# Altium project SoldeerStation2223.PrjPcb
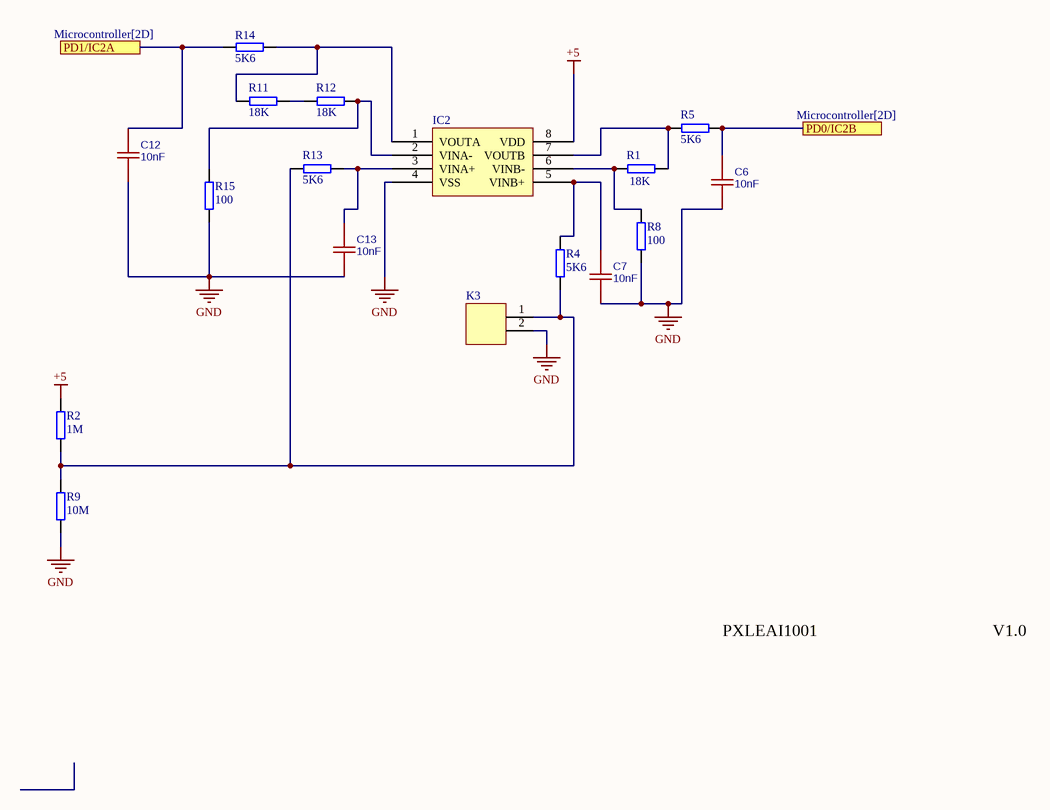
[diagram p0: Thermokoppel.SchDoc]
5 sheets, 78 parts. Net scope: flat (ports and power ports of the same name join across sheets).
Board files: PCBV1.PcbDoc, Display.PcbDoc, PCBV2.PcbDoc
Sheets:
  Thermokoppel.SchDoc
  Voeding.SchDoc
  Display.SchDoc
  Microcontroller.SchDoc
  PWMSoldeerbout.SchDoc

## Sheet Thermokoppel.SchDoc: Soldeerstation
size A4; Author: Alexander Petry; CompanyName: PXL; SheetNumber: 1; SheetTotal: 5

### Parts
C6  10nF  [C6,7,12,13 10nF]
C7  10nF  [C6,7,12,13 10nF]
C12  10nF  [C6,7,12,13 10nF]
C13  10nF  [C6,7,12,13 10nF]
IC2  (no value)  [IC2 opamps]
K3  (no value)  [Terminal_2]
R1  18K  [RESC2013X50X30ML20T20]
R2  1M  [RESC2013X50X30ML20T20]
R4  5K6  [RESC2013X50X30ML20T20]
R5  5K6  [RESC2013X50X30ML20T20]
R8  100  [RESC2013X50X30ML20T20]
R9  10M  [RESC2013X50X30ML20T20]
R11  18K  [RESC2013X50X30ML20T20]
R12  18K  [RESC2013X50X30ML20T20]
R13  5K6  [RESC2013X50X30ML20T20]
R14  5K6  [RESC2013X50X30ML20T20]
R15  100  [RESC2013X50X30ML20T20]

### Ports
PD0/IC2B (see Microcontroller[2D]), PD1/IC2A (see Microcontroller[2D])

### Nets
+5: IC2.8(VDD) R2.2
GND: C6.1 C7.1 C12.1 C13.1 IC2.4(VSS) K3.2 R8.1 R9.1 R15.1
NetC6_2: C6.2 R5.1 ; port PD0/IC2B
NetC7_2: C7.2 IC2.5(VINB+) R4.1
NetC12_2: C12.2 R14.1 ; port PD1/IC2A
NetC13_2: C13.2 IC2.3(VINA+) R13.2
NetIC2_1: IC2.1(VOUTA) R11.2 R14.2
NetIC2_2: IC2.2(VINA-) R12.2 R15.2
NetIC2_6: IC2.6(VINB-) R1.1 R8.2
NetIC2_7: IC2.7(VOUTB) R1.2 R5.2
NetK3_1: K3.1 R2.1 R4.2 R9.2 R13.1
NetR11_1: R11.1 R12.1

### Notes on the sheet
- PXLEAI1001
- V1.0

### Library data of the parts
C6 C7 C12 C13 = C6,7,12,13 10nF: BOM_Manufacturer: CCTC(三环); BOM_Manufacturer Part: TCC0805X7R103M500DT; nameAlias: Capacitance; Contributor: LCSC; BOM_Supplier: LCSC; BOM_Supplier Part: C376921; BOM_JLCPCB Part Class: Extended Part; spicePre: C; spiceSymbolName: TCC0805X7R103M500DT
IC2 = IC2 dual opamps
K3 = K Terminal_2
R1 R2 R4 R5 R8 R9 R11-R15 = R Resistor: Manufacturer: Vishay Dale; Part Number: CRCW08050000Z0EA

## Sheet Voeding.SchDoc
size A4; SheetNumber: 2; SheetTotal: 5
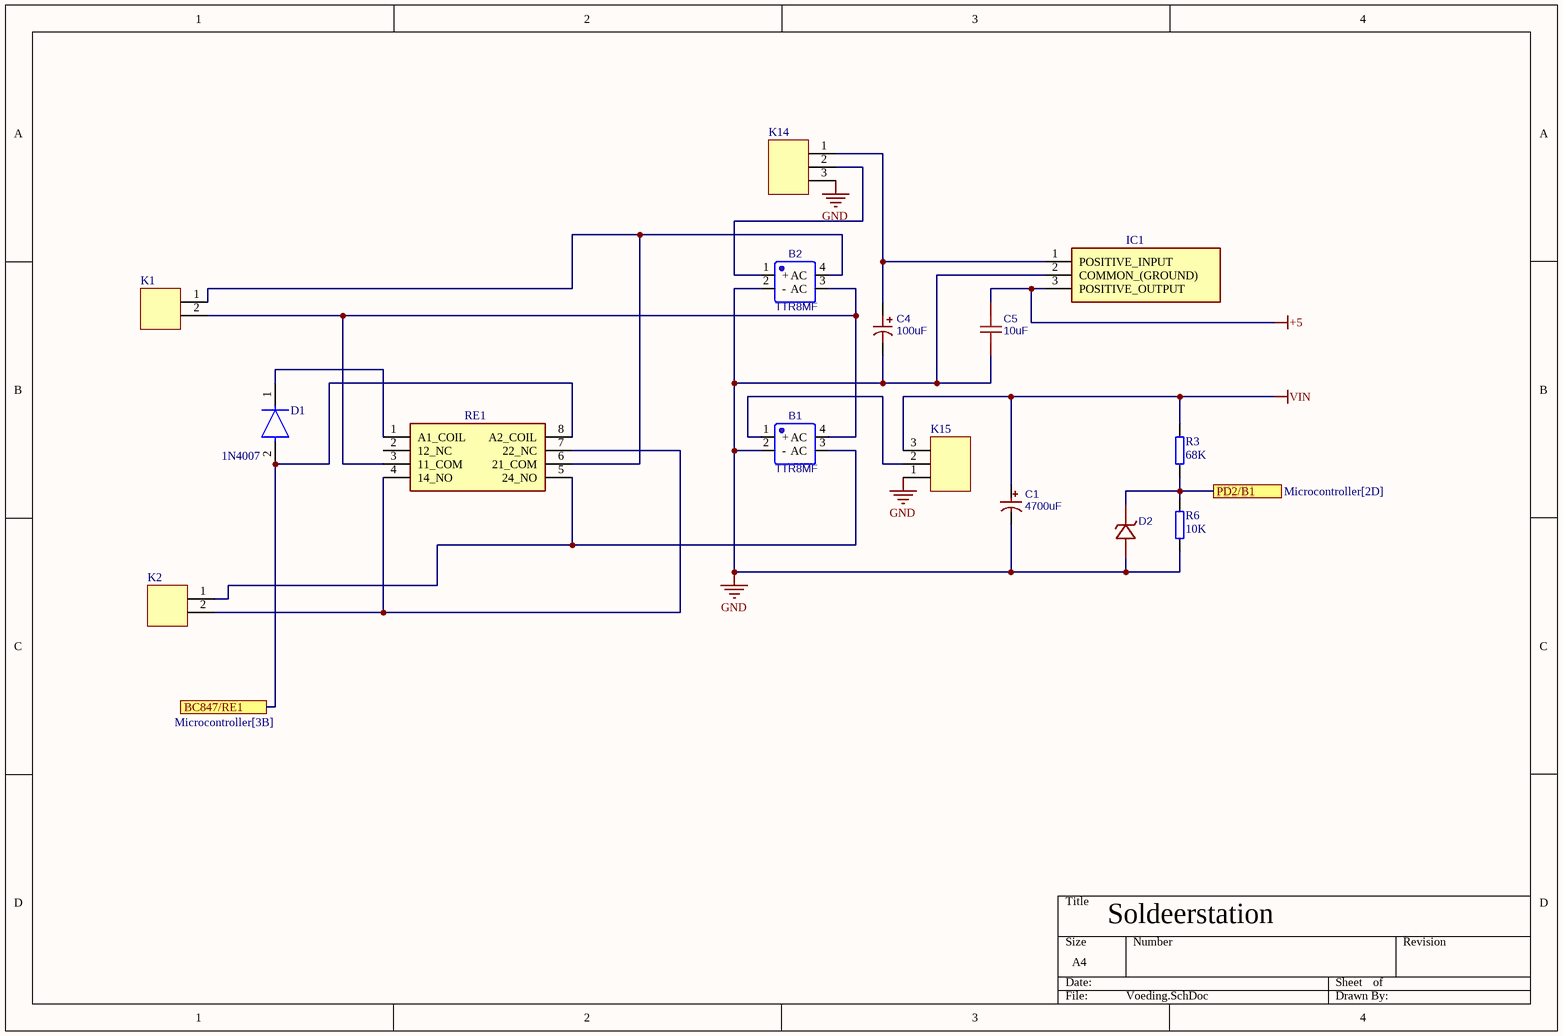
[diagram p1: Voeding.SchDoc]

### Parts
B1  TTR8MF  [B1,2 Brug gelijkrichter]
B2  TTR8MF  [B1,2 Brug gelijkrichter]
C1  4700uF  [C1 4700uF]
C4  100uF  [C4 100uF]
C5  10uF  [C2,5,10 10uF]
D1  1N4007  [FP-1N4007-MFG]
D2  (no value)  [D2 zener diode]
IC1  (no value)  [IC1 DC-DC converter]
K1  (no value)  [Terminal_2]
K2  (no value)  [Terminal_2]
K14  (no value)  [PInHeader_3]
K15  (no value)  [PInHeader_3]
R3  68K  [RESC2013X50X30ML20T20]
R6  10K  [RESC2013X50X30ML20T20]
RE1  (no value)  [RE1 Vermogen relais]

### Ports
BC847/RE1 (see Microcontroller[3B]), PD2/B1 (see Microcontroller[2D])

### Nets
+5: C5.2 IC1.3(POSITIVE_OUTPUT)
GND: B1.2(-) B2.2(-) C1.2 C4.2 C5.1 D2.2(A) IC1.2(COMMON_(GROUND)) K14.3 K15.1 R6.1
VIN: C1.1 K15.3 R3.2
NetB1_1: B1.1(+) K15.2
NetB1_3: B1.3(AC) K2.1 RE1.5(24_NO)
NetB1_4: B1.4(AC) B2.3(AC) K1.2 RE1.3(11_COM)
NetB2_1: B2.1(+) K14.2
NetB2_4: B2.4(AC) K1.1 RE1.6(21_COM)
NetC4_1: C4.1 IC1.1(POSITIVE_INPUT) K14.1
NetD1_1: D1.1(C) RE1.1(A1_COIL)
NetD1_2: D1.2(A) RE1.8(A2_COIL) ; port BC847/RE1
NetD2_1: D2.1(K) R3.1 R6.2 ; port PD2/B1
NetK2_2: K2.2 RE1.4(14_NO) RE1.7(22_NC)

Not connected (* = marked no-connect by the designer): RE1 2(12_NC)

### Notes on the sheet
- Soldeerstation

### Library data of the parts
B1 B2 = B1,2 Brug Gelijkrichter: BOM_Manufacturer: MDD; Contributor: LCSC; BOM_Supplier: LCSC; BOM_Supplier Part: C712546; BOM_Manufacturer Part: TTR8MF; BOM_JLCPCB Part Class: Extended Part; spicePre: D; spiceSymbolName: TTR8MF
C1 = C1 4700uF: BOM_Manufacturer: CX(承兴); BOM_Manufacturer Part: KM478M050N35RR0VH2FP0; nameAlias: Capacitance; BOM_Supplier: LCSC; BOM_Supplier Part: C45662; BOM_JLCPCB Part Class: Extended Part; spicePre: C; spiceSymbolName: 4700uF 50V 22*35
C4 = C4 100uF: BOM_Manufacturer: Nichicon(尼吉康); BOM_Manufacturer Part: UWT1H101MNL1GS; Contributor: LCSC; nameAlias: Capacitance; BOM_Supplier: LCSC; BOM_Supplier Part: C445063; BOM_JLCPCB Part Class: Extended Part; spicePre: C; spiceSymbolName: UWT1H101MNL1GS
C5 = C2,5,10 10uF: BOM_Manufacturer: muRata(村田); BOM_Manufacturer Part: GRM21BR61H106KE43L; nameAlias: Capacitance; Contributor: LCSC; BOM_Supplier: LCSC; BOM_Supplier Part: C440198; BOM_JLCPCB Part Class: Basic Part; spicePre: C; spiceSymbolName: GRM21BR61H106KE43L
D1 = zo_1N4007: DIODE GEN PURP 1KV 1A DO204AL; Manufacturer: Vishay; Manufacturer Part Number: 1N4007-E3/54; Value: 15pF; Max Junction Temp: +150°C; Max Surge Forward Current: 30A; Max Repetitive Reverse Voltage: 1000V; Peak Reverse Current: 30uA; Octopart: https://octopart.com/1n4007-e3%2F54-vishay-39548207; Digikey Description: DIODE GEN PURP 1KV 1A DO204AL; Category: Diode; Mouser Description: Rectifiers Vr/1000V Io/1A; Automotive: No; Package: 1N4007; Device Class L3: Rectifier Diodes; Temperature Range High: +150°C; Capacitance: 15pF; Ipc Land Pattern Name: DIOPA1088W105L520D270; Lead Free: Yes; ComponentLink2Description: Datasheet; Forward Current: 1A; Device Class L1: Discrete Semiconductors; ComponentLink2URL: http://www.vishay.com/docs/88503/1n4001.pdf; Temperature Range Low: -50°C; Height: 2.7mm; RoHS: TRUE; Temperature: -50°C to +150°C; Device Class L2: Diodes
D2 = D2 zener diode: BZT52C5V1_C1884555; BOM_Manufacturer: YFW(佑风微); Contributor: LCSC; BOM_Supplier: LCSC; BOM_Supplier Part: C1884555; BOM_Manufacturer Part: BZT52C5V1; BOM_JLCPCB Part Class: Extended Part; spicePre: D; spiceSymbolName: BZT52C5V1_C1884555
IC1 = IC1 OKI-78SR-5_1.5-W36-C: Non-Isolated DC/DC Converters 7.5W 24Vin 5Vout1 1.5A SIP Non-Iso; Manufacturer_Name: Murata Electronics; Manufacturer_Part_Number: OKI-78SR-5/1.5-W36-C; Geometry.Height: 16.5mm; Mouser Part Number: 580-OKI78SR5/1.5W36C; Mouser Price/Stock: https://www.mouser.co.uk/ProductDetail/Murata-Power-Solutions/OKI-78SR-5-1.5-W36-C?qs=uJpRT2lXVNXJP%252Bo08dQqJQ%3D%3D; Datasheet Link: https://www.murata.com/products/productdata/8807037992990/oki-78sr.pdf?1583754815000
K1 K2 = K Terminal_2
K14 K15 = K PinHeader_3
R3 R6 = R Resistor: as R1 on sheet Thermokoppel
RE1 = RE1 Vermogen relais: RT424005F  General Purpose Relays DPDT 8A 5VDC GEN PURPOSE RELAY; Manufacturer_Name: TE Connectivity; Mouser Part Number: 655-RT424005F; Mouser Price/Stock: https://www.mouser.co.uk/ProductDetail/TE-Connectivity-PB/RT424005F?qs=8wHch9UpSvaH%252B%252BmsSCbj0Q%3D%3D; Manufacturer_Part_Number: RT424005F; Datasheet Link: https://datasheet.datasheetarchive.com/originals/distributors/Datasheets_SAMA/2ef22a7a34dcc6453ddb52063c55ccaa.pdf

## Sheet Display.SchDoc
size A4; SheetNumber: 3; SheetTotal: 5
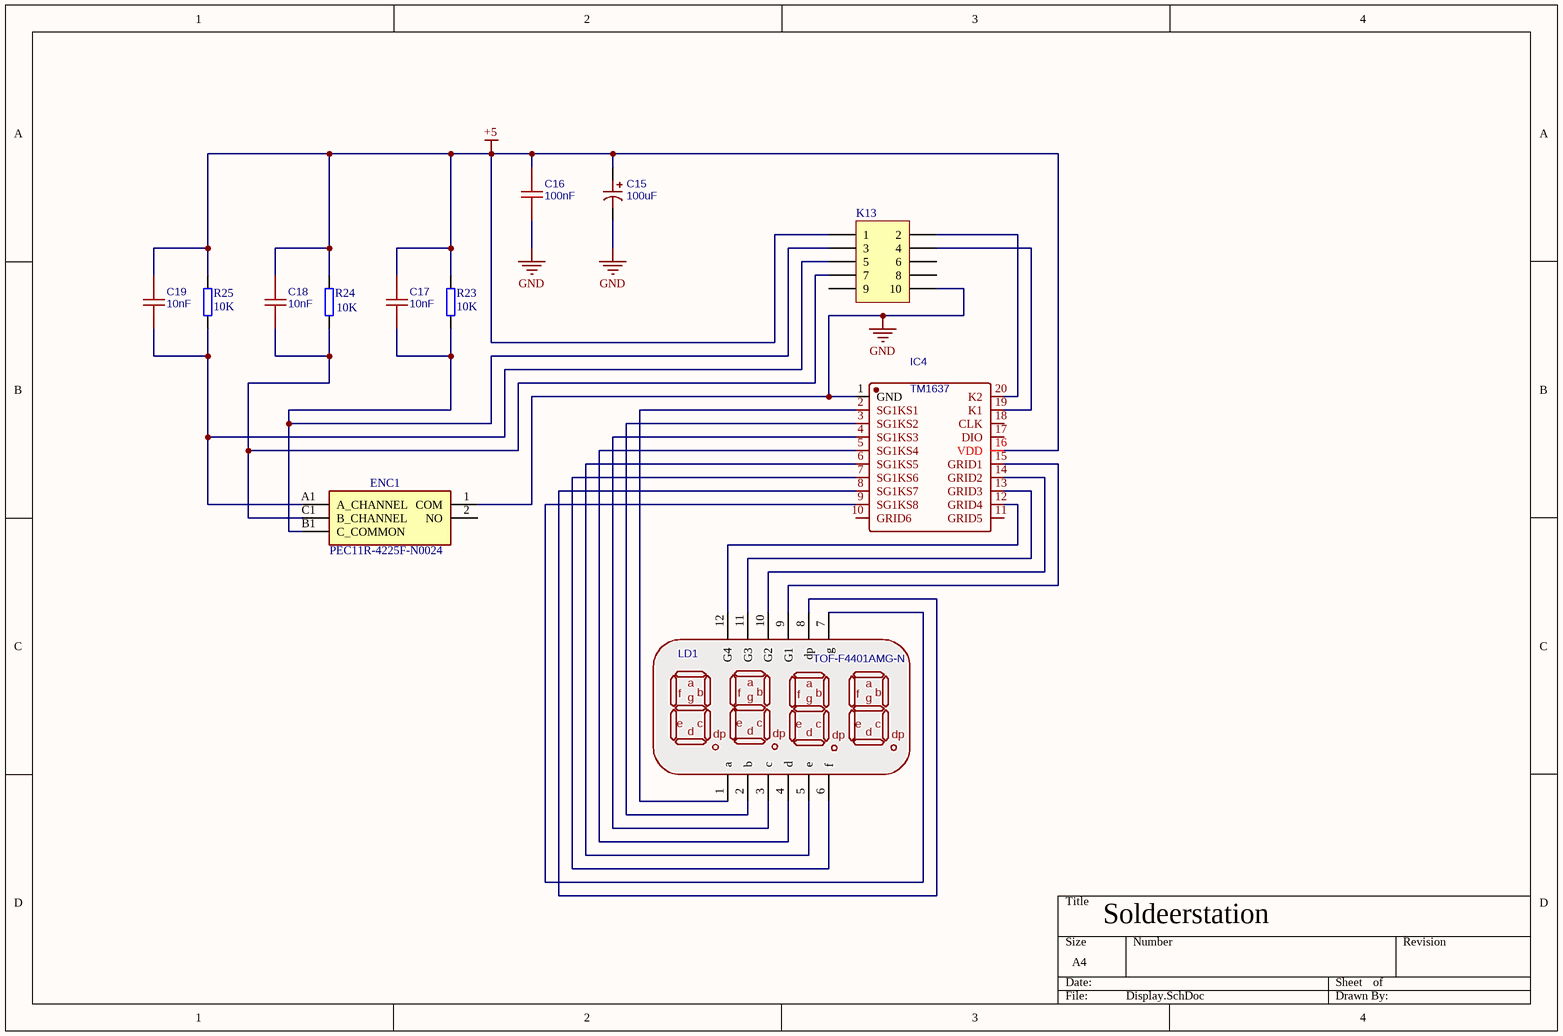
[diagram p2: Display.SchDoc]

### Parts
C15  100uF  [C4 100uF]
C16  100nF  [C6,7,12,13 10nF]
C17  10nF  [C6,7,12,13 10nF]
C18  10nF  [C6,7,12,13 10nF]
C19  10nF  [C6,7,12,13 10nF]
ENC1  PEC11R-4225F-N0024  [ENC1 draai encoder]
IC4  TM1637  [IC4 Led driver]
K13  (no value)  [HDR2X5]
LD1  TOF-F4401AMG-N  [LED1]
R23  10K  [RESC2013X50X30ML20T20]
R24  10K  [RESC2013X50X30ML20T20]
R25  10K  [RESC2013X50X30ML20T20]

### Nets
+5: C15.1 C16.2 C17.2 C18.2 C19.2 IC4.16(VDD) K13.1 R23.2 R24.2 R25.2
GND: C15.2 C16.1 ENC1.1(COM) IC4.1(GND) K13.10
NetC17_1: C17.1 ENC1.B1(C_COMMON) K13.3 R23.1
NetC18_1: C18.1 ENC1.C1(B_CHANNEL) K13.7 R24.1
NetC19_1: C19.1 ENC1.A1(A_CHANNEL) K13.5 R25.1
NetIC4_2: IC4.2(SG1KS1) LD1.1(a)
NetIC4_3: IC4.3(SG1KS2) LD1.2(b)
NetIC4_4: IC4.4(SG1KS3) LD1.3(c)
NetIC4_5: IC4.5(SG1KS4) LD1.4(d)
NetIC4_6: IC4.6(SG1KS5) LD1.5(e)
NetIC4_7: IC4.7(SG1KS6) LD1.6(f)
NetIC4_8: IC4.8(SG1KS7) LD1.8(dp)
NetIC4_9: IC4.9(SG1KS8) LD1.7(g)
NetIC4_12: IC4.12(GRID4) LD1.12(G4)
NetIC4_13: IC4.13(GRID3) LD1.11(G3)
NetIC4_14: IC4.14(GRID2) LD1.10(G2)
NetIC4_15: IC4.15(GRID1) LD1.9(G1)
NetIC4_19: IC4.19(K1) K13.4
NetIC4_20: IC4.20(K2) K13.2

Not connected (* = marked no-connect by the designer): ENC1 2(NO); IC4 10(GRID6) 11(GRID5) 17(DIO) 18(CLK); K13 6 8 9

### Notes on the sheet
- Soldeerstation

### Library data of the parts
C15 = C4 100uF: as C4 on sheet Voeding; BOM_Supplier: LCSC; BOM_Supplier Part: C445063; BOM_JLCPCB Part Class: Extended Part; spicePre: C; spiceSymbolName: UWT1H101MNL1GS
C16-C19 = C6,7,12,13 10nF: as C6 on sheet Thermokoppel; BOM_Supplier: LCSC; BOM_Supplier Part: C376921; BOM_JLCPCB Part Class: Extended Part; spicePre: C; spiceSymbolName: TCC0805X7R103M500DT
ENC1 = ENC1 Draai encoder: PEC11R-4225F-N0024Mechanical Encoder Rotary Incremental Flat 0.007N.m Straight Quadrature Digital Square Wave 24PPR Through Hole PC Pin; Manufacturer_Name: Bourns; Geometry.Height: 31.5mm; Mouser Part Number: 652-PEC11R-4225F-N24; Mouser Price/Stock: https://www.mouser.co.uk/ProductDetail/Bourns/PEC11R-4225F-N0024?qs=Zq5ylnUbLm6NTsWtgy%252B2Zg%3D%3D; Manufacturer_Part_Number: PEC11R-4225F-N0024; Datasheet Link: https://www.bourns.com/docs/Product-Datasheets/PEC11R.pdf
IC4 = IC4 Led driver: TM1637(TA2007); BOM_Manufacturer: TM(天微); Contributor: lcsc; BOM_Supplier: LCSC; BOM_Supplier Part: C5337160; BOM_Manufacturer Part: TM1637(TA2007); BOM_JLCPCB Part Class: Extended Part; spicePre: U; spiceSymbolName: TM1637(TA2007)
K13 = Header 5X2: Header, 5-Pin, Dual row; LatestRevisionDate: 17-Jul-2002; LatestRevisionNote: Re-released for DXP Platform.; Publisher: Altium Limited
LD1 = LED1: BOM_Manufacturer: OASIS(李洲); Contributor: LCSC; BOM_Supplier: LCSC; BOM_Supplier Part: C325426; BOM_Manufacturer Part: TOF-F4401AMG-N; BOM_JLCPCB Part Class: Extended Part; spicePre: L; spiceSymbolName: TOF-F4401AMG-N
R23-R25 = R Resistor: as R1 on sheet Thermokoppel

## Sheet Microcontroller.SchDoc
size A4; SheetNumber: 4; SheetTotal: 5
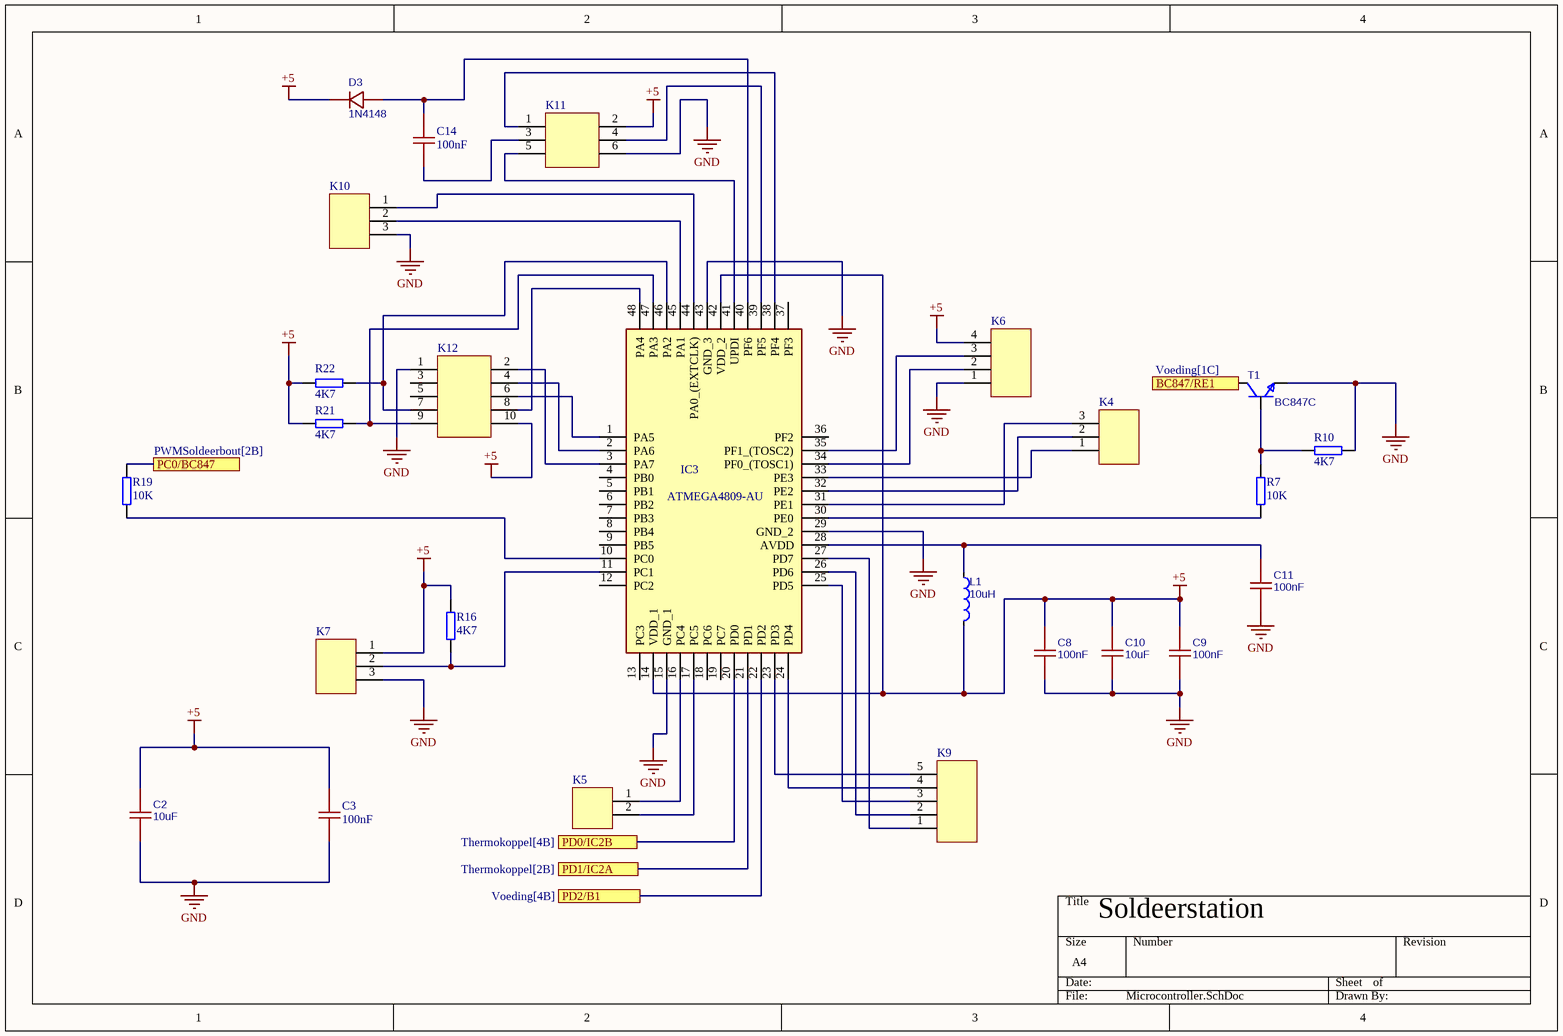
[diagram p3: Microcontroller.SchDoc]

### Parts
C2  10uF  [C2,5,10 10uF]
C3  100nF  [C6,7,12,13 10nF]
C8  100nF  [C6,7,12,13 10nF]
C9  100nF  [C6,7,12,13 10nF]
C10  10uF  [C2,5,10 10uF]
C11  100nF  [C6,7,12,13 10nF]
C14  100nF  [C6,7,12,13 10nF]
D3  1N4148  [D3 1N14148]
IC3  ATMEGA4809-AU  [IC3 ATMEGA4809-AU]
K4  (no value)  [PInHeader_3]
K5  (no value)  [PInHeader_2]
K6  (no value)  [PInHeader_4]
K7  (no value)  [PInHeader_3]
K9  (no value)  [PInHeader_5]
K10  (no value)  [PInHeader_3]
K11  (no value)  [PInHeader_6]
K12  (no value)  [BOxHeader_10]
L1  10uH  [L2 SmoorSpoel]
R7  10K  [RESC2013X50X30ML20T20]
R10  4K7  [RESC2013X50X30ML20T20]
R16  4K7  [RESC2013X50X30ML20T20]
R19  10K  [RESC2013X50X30ML20T20]
R21  4K7  [RESC2013X50X30ML20T20]
R22  4K7  [RESC2013X50X30ML20T20]
T1  BC847C  [T1,2,4 Bipolar Transistors]

### Ports
BC847/RE1 (see Voeding[1C]), PC0/BC847 (see PWMSoldeerbout[2B]), PD0/IC2B (see Thermokoppel[4B]), PD1/IC2A (see Thermokoppel[2B]), PD2/B1 (see Voeding[4B])

### Nets
+5: C2.2 C3.2 C8.1 C9.1 C10.2 D3.1(C) IC3.14(VDD_1) IC3.42(VDD_2) K6.4 K7.1 K11.2 K12.10 L1.2 R16.2 R21.1 R22.1
GND: C2.1 C3.1 C8.2 C9.2 C10.1 C11.2 IC3.15(GND_1) IC3.29(GND_2) IC3.43(GND_3) K6.1 K7.3 K10.3 K11.6 K12.1 R10.2 T1.2(E)
NetC6_2: IC3.20(PD0) ; port PD0/IC2B
NetC11_1: C11.1 IC3.28(AVDD) L1.1
NetC12_2: IC3.21(PD1) ; port PD1/IC2A
NetC14_1: C14.1 K11.3
NetC14_2: C14.2 D3.2(A) IC3.40(PF6)
NetD2_1: IC3.22(PD2) ; port PD2/B1
NetIC3_1: IC3.1(PA5) K12.6
NetIC3_2: IC3.2(PA6) K12.4
NetIC3_3: IC3.3(PA7) K12.2
NetIC3_10: IC3.10(PC0) R19.1
NetIC3_11: IC3.11(PC1) K7.2 R16.1
NetIC3_16: IC3.16(PC4) K5.1
NetIC3_17: IC3.17(PC5) K5.2
NetIC3_23: IC3.23(PD3) K9.5
NetIC3_24: IC3.24(PD4) K9.4
NetIC3_25: IC3.25(PD5) K9.3
NetIC3_26: IC3.26(PD6) K9.2
NetIC3_27: IC3.27(PD7) K9.1
NetIC3_30: IC3.30(PE0) R7.1
NetIC3_31: IC3.31(PE1) K4.3
NetIC3_32: IC3.32(PE2) K4.2
NetIC3_33: IC3.33(PE3) K4.1
NetIC3_34: IC3.34(PF0_(TOSC1)) K6.2
NetIC3_35: IC3.35(PF1_(TOSC2)) K6.3
NetIC3_38: IC3.38(PF4) K11.1
NetIC3_39: IC3.39(PF5) K11.4
NetIC3_41: IC3.41(UPDI) K11.5
NetIC3_44: IC3.44(PA0_(EXTCLK)) K10.1
NetIC3_45: IC3.45(PA1) K10.2
NetIC3_46: IC3.46(PA2) K12.7 R22.2
NetIC3_47: IC3.47(PA3) K12.9 R21.2
NetIC3_48: IC3.48(PA4) K12.8
NetR7_2: R7.2 R10.1 T1.1(B)
NetR19_2: R19.2 ; port PC0/BC847

Not connected (* = marked no-connect by the designer): IC3 4(PB0) 5(PB1) 6(PB2) 7(PB3) 8(PB4) 9(PB5) 12(PC2) 13(PC3) 18(PC6) 19(PC7) 36(PF2) 37(PF3); K12 3 5; T1 3(C)

### Notes on the sheet
- Soldeerstation

### Library data of the parts
C2 C10 = C2,5,10 10uF: as C5 on sheet Voeding; BOM_Supplier: LCSC; BOM_Supplier Part: C440198; BOM_JLCPCB Part Class: Basic Part; spicePre: C; spiceSymbolName: GRM21BR61H106KE43L
C3 C14 = C 100nF
C8 C9 C11 = C6,7,12,13 10nF: as C6 on sheet Thermokoppel; BOM_Supplier: LCSC; BOM_Supplier Part: C376921; BOM_JLCPCB Part Class: Extended Part; spicePre: C; spiceSymbolName: TCC0805X7R103M500DT
D3 = D3 1N14148: 1N4148W-C84367; BOM_Manufacturer: MDD; BOM_Supplier: LCSC; BOM_Manufacturer Part: 1N4148W; BOM_Supplier Part: C84367; BOM_JLCPCB Part Class: Extended Part; spicePre: D; spiceSymbolName: 1N4148W-C84367
IC3 = IC3 ATMEGA4809-AU: 8-bit Microcontrollers - MCU 20MHz, 48KB, TQFP; Manufacturer_Name: Microchip; Geometry.Height: 1.2mm; Mouser Part Number: 556-ATMEGA4809-AU; Mouser Price/Stock: https://www.mouser.co.uk/ProductDetail/Microchip-Technology-Atmel/ATMEGA4809-AU?qs=P1JMDcb91o4zLIorxO9tIg%3D%3D; Manufacturer_Part_Number: ATMEGA4809-AU; Datasheet Link: *
K4 K7 K10 = K PinHeader_3
K5 = K PinHeader_2
K6 = K PinHeader_4
K9 = K PinHeader_5
K11 = K PinHeader_6
K12 = K Boxheader_10
L1 = L2 smoorspoel: BOM_Manufacturer: KOHERelec(科或); BOM_Manufacturer Part: PMI201214S-100M; nameAlias: Inductance; Contributor: LCSC; BOM_Supplier: LCSC; BOM_Supplier Part: C2922559; BOM_JLCPCB Part Class: Extended Part; spicePre: L; spiceSymbolName: PMI201214S-100M
R7 R10 R16 R19 R21 R22 = R Resistor: as R1 on sheet Thermokoppel
T1 = T1,2,4 transisitors: BC847C_C3027113; BOM_Manufacturer: SALLTECH(萨瑞); Contributor: lcsc; BOM_Supplier: LCSC; BOM_Supplier Part: C3027113; BOM_Manufacturer Part: BC847C; link: https://atta.szlcsc.com/upload/public/pdf/source/20220824/287706FC7904CA05889B348536529CCD.pdf; BOM_JLCPCB Part Class: Extended Part; spicePre: Q; spiceSymbolName: BC847C_C3027113

## Sheet PWMSoldeerbout.SchDoc
size A4; SheetNumber: 5; SheetTotal: 5
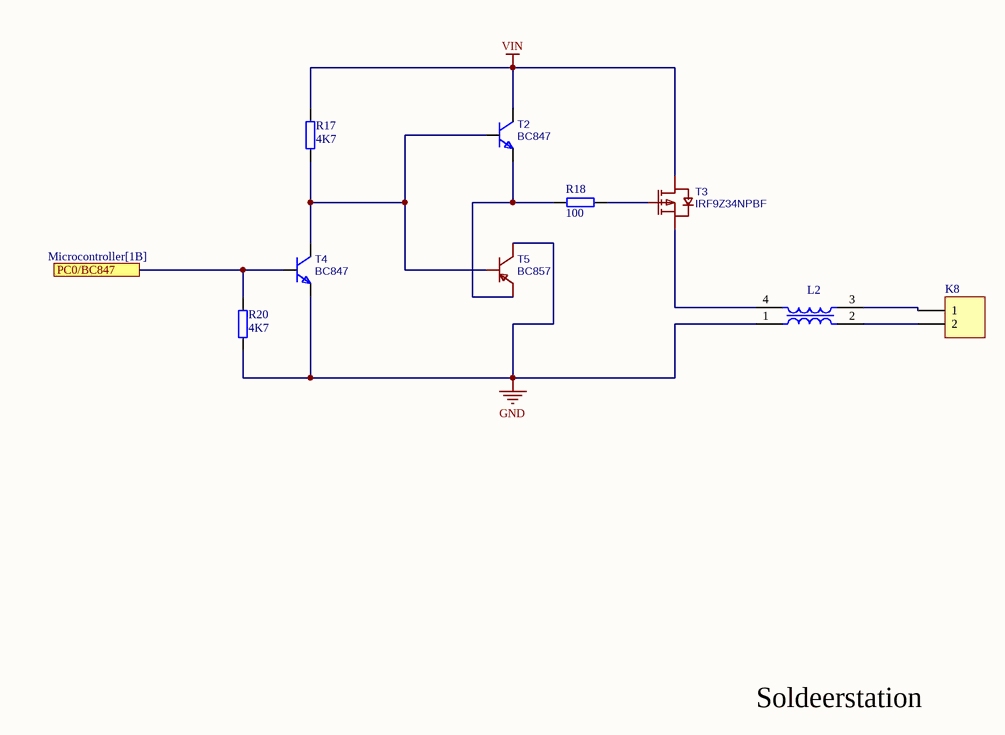
[diagram p4: PWMSoldeerbout.SchDoc]

### Parts
K8  (no value)  [HDR1X2]
L2  (no value)  [L1 Smoorspoel]
R17  4K7  [RESC2013X50X30ML20T20]
R18  100  [RESC2013X50X30ML20T20]
R20  4K7  [RESC2013X50X30ML20T20]
T2  BC847  [T1,2,4 Bipolar Transistors]
T3  IRF9Z34NPBF  [T3 MOSFET-P]
T4  BC847  [T1,2,4 Bipolar Transistors]
T5  BC857  [T5 Bipolar Transistors]

### Ports
PC0/BC847 (see Microcontroller[1B])

### Nets
GND: L2.1 R20.1 T4.2(E) T5.3
VIN: R17.2 T2.3(C) T3.2(D)
NetK8_1: K8.1 L2.3
NetK8_2: K8.2 L2.2
NetL2_4: L2.4 T3.3(S)
NetR17_1: R17.1 T2.1(B) T4.3(C) T5.1
NetR18_1: R18.1 T3.1(G)
NetR18_2: R18.2 T2.2(E) T5.2
NetR19_2: R20.2 T4.1(B) ; port PC0/BC847

### Notes on the sheet
- Soldeerstation

### Library data of the parts
K8 = Header 2: Header, 2-Pin; LatestRevisionDate: 17-Jul-2002; LatestRevisionNote: Re-released for DXP Platform.; Publisher: Altium Limited
L2 = L2 Common Mode Choke: Common Mode Chokes / Filters 170ohms 100MHz 10A 1 Choke SMD; Manufacturer_Name: Laird Performance Materials; Manufacturer_Part_Number: CM2545X171R-10; Geometry.Height: 9.5mm; Mouser Part Number: 875-CM2545X171R-10; Mouser Price/Stock: https://www.mouser.co.uk/ProductDetail/Laird-Performance-Materials/CM2545X171R-10?qs=gHrF1kHvtHWa9UjYzLX7bQ%3D%3D; Datasheet Link: https://componentsearchengine.com/Datasheets/1/CM2545X171R-10.pdf
R17 R18 R20 = R Resistor: as R1 on sheet Thermokoppel
T2 T4 = T1,2,4 transisitors: BC847C_C3027113; BOM_Manufacturer: SALLTECH(萨瑞); BOM_Manufacturer Part: BC847C; Contributor: lcsc; BOM_Supplier: LCSC; BOM_Supplier Part: C3027113; link: https://atta.szlcsc.com/upload/public/pdf/source/20220824/287706FC7904CA05889B348536529CCD.pdf; BOM_JLCPCB Part Class: Extended Part; spicePre: Q; spiceSymbolName: BC847C_C3027113
T3 = T3 MOSFET-P: BOM_Manufacturer: Infineon(英飞凌); Contributor: LCSC; BOM_Supplier: LCSC; BOM_Supplier Part: C500523; BOM_Manufacturer Part: IRF9Z34NPBF; BOM_JLCPCB Part Class: Extended Part; spicePre: Q; spiceSymbolName: IRF9Z34NPBF
T5 = T5 Bipolar Transistor: BC857 3G; BOM_Manufacturer: CJ(江苏长电/长晶); BOM_Supplier: LCSC; BOM_Manufacturer Part: BC857; BOM_Supplier Part: C2139; BOM_JLCPCB Part Class: Extended Part; spicePre: Q; spiceSymbolName: BC857 3G

## Nets that join several sheets
+5: Thermokoppel (IC2.8 R2.2), Voeding (C5.2 IC1.3), Display (10 pins), Microcontroller (16 pins)
GND: Thermokoppel (9 pins), Voeding (10 pins), Display (5 pins), Microcontroller (16 pins), PWMSoldeerbout (L2.1 R20.1 T4.2 T5.3)
VIN: Voeding (C1.1 K15.3 R3.2), PWMSoldeerbout (R17.2 T2.3 T3.2)
NetC6_2: Thermokoppel (C6.2 R5.1), Microcontroller (IC3.20)
NetC12_2: Thermokoppel (C12.2 R14.1), Microcontroller (IC3.21)
NetD2_1: Voeding (D2.1 R3.1 R6.2), Microcontroller (IC3.22)
NetR19_2: Microcontroller (R19.2), PWMSoldeerbout (R20.2 T4.1)